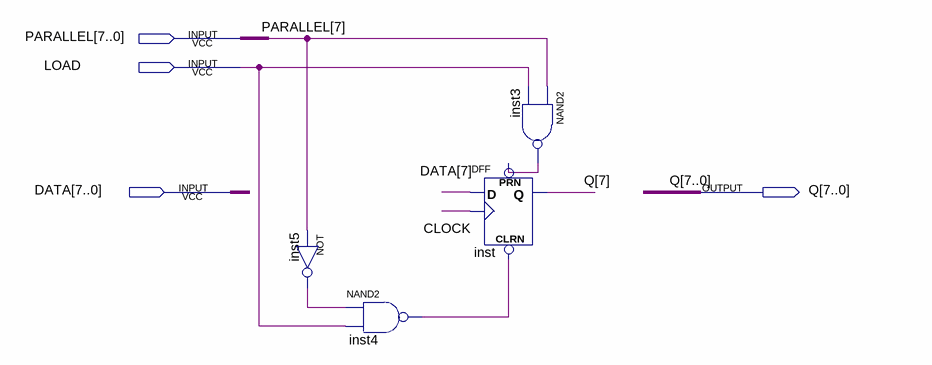
[diagram p0: schematic sheet]
// Quartus schematic register_8bit.bdf as structural Verilog: 4 symbols, 4 pins
module register_8bit (
  input  [7:0] PARALLEL,
  input  LOAD,
  input  [7:0] DATA,
  output [7:0] Q
);

  wire CLOCK, inst3_out, inst4_out, inst5_out;

  not inst5 (inst5_out, PARALLEL[7]);
  nand inst4 (inst4_out, inst5_out, LOAD);
  nand inst3 (inst3_out, PARALLEL[7], LOAD);
  DFF inst (.CLRN(inst4_out), .CLK(CLOCK), .D(DATA[7]), .PRN(inst3_out), .Q(Q[7]));
endmodule
